# Altium schematic sheet Power Regulation.SchDoc
size A3
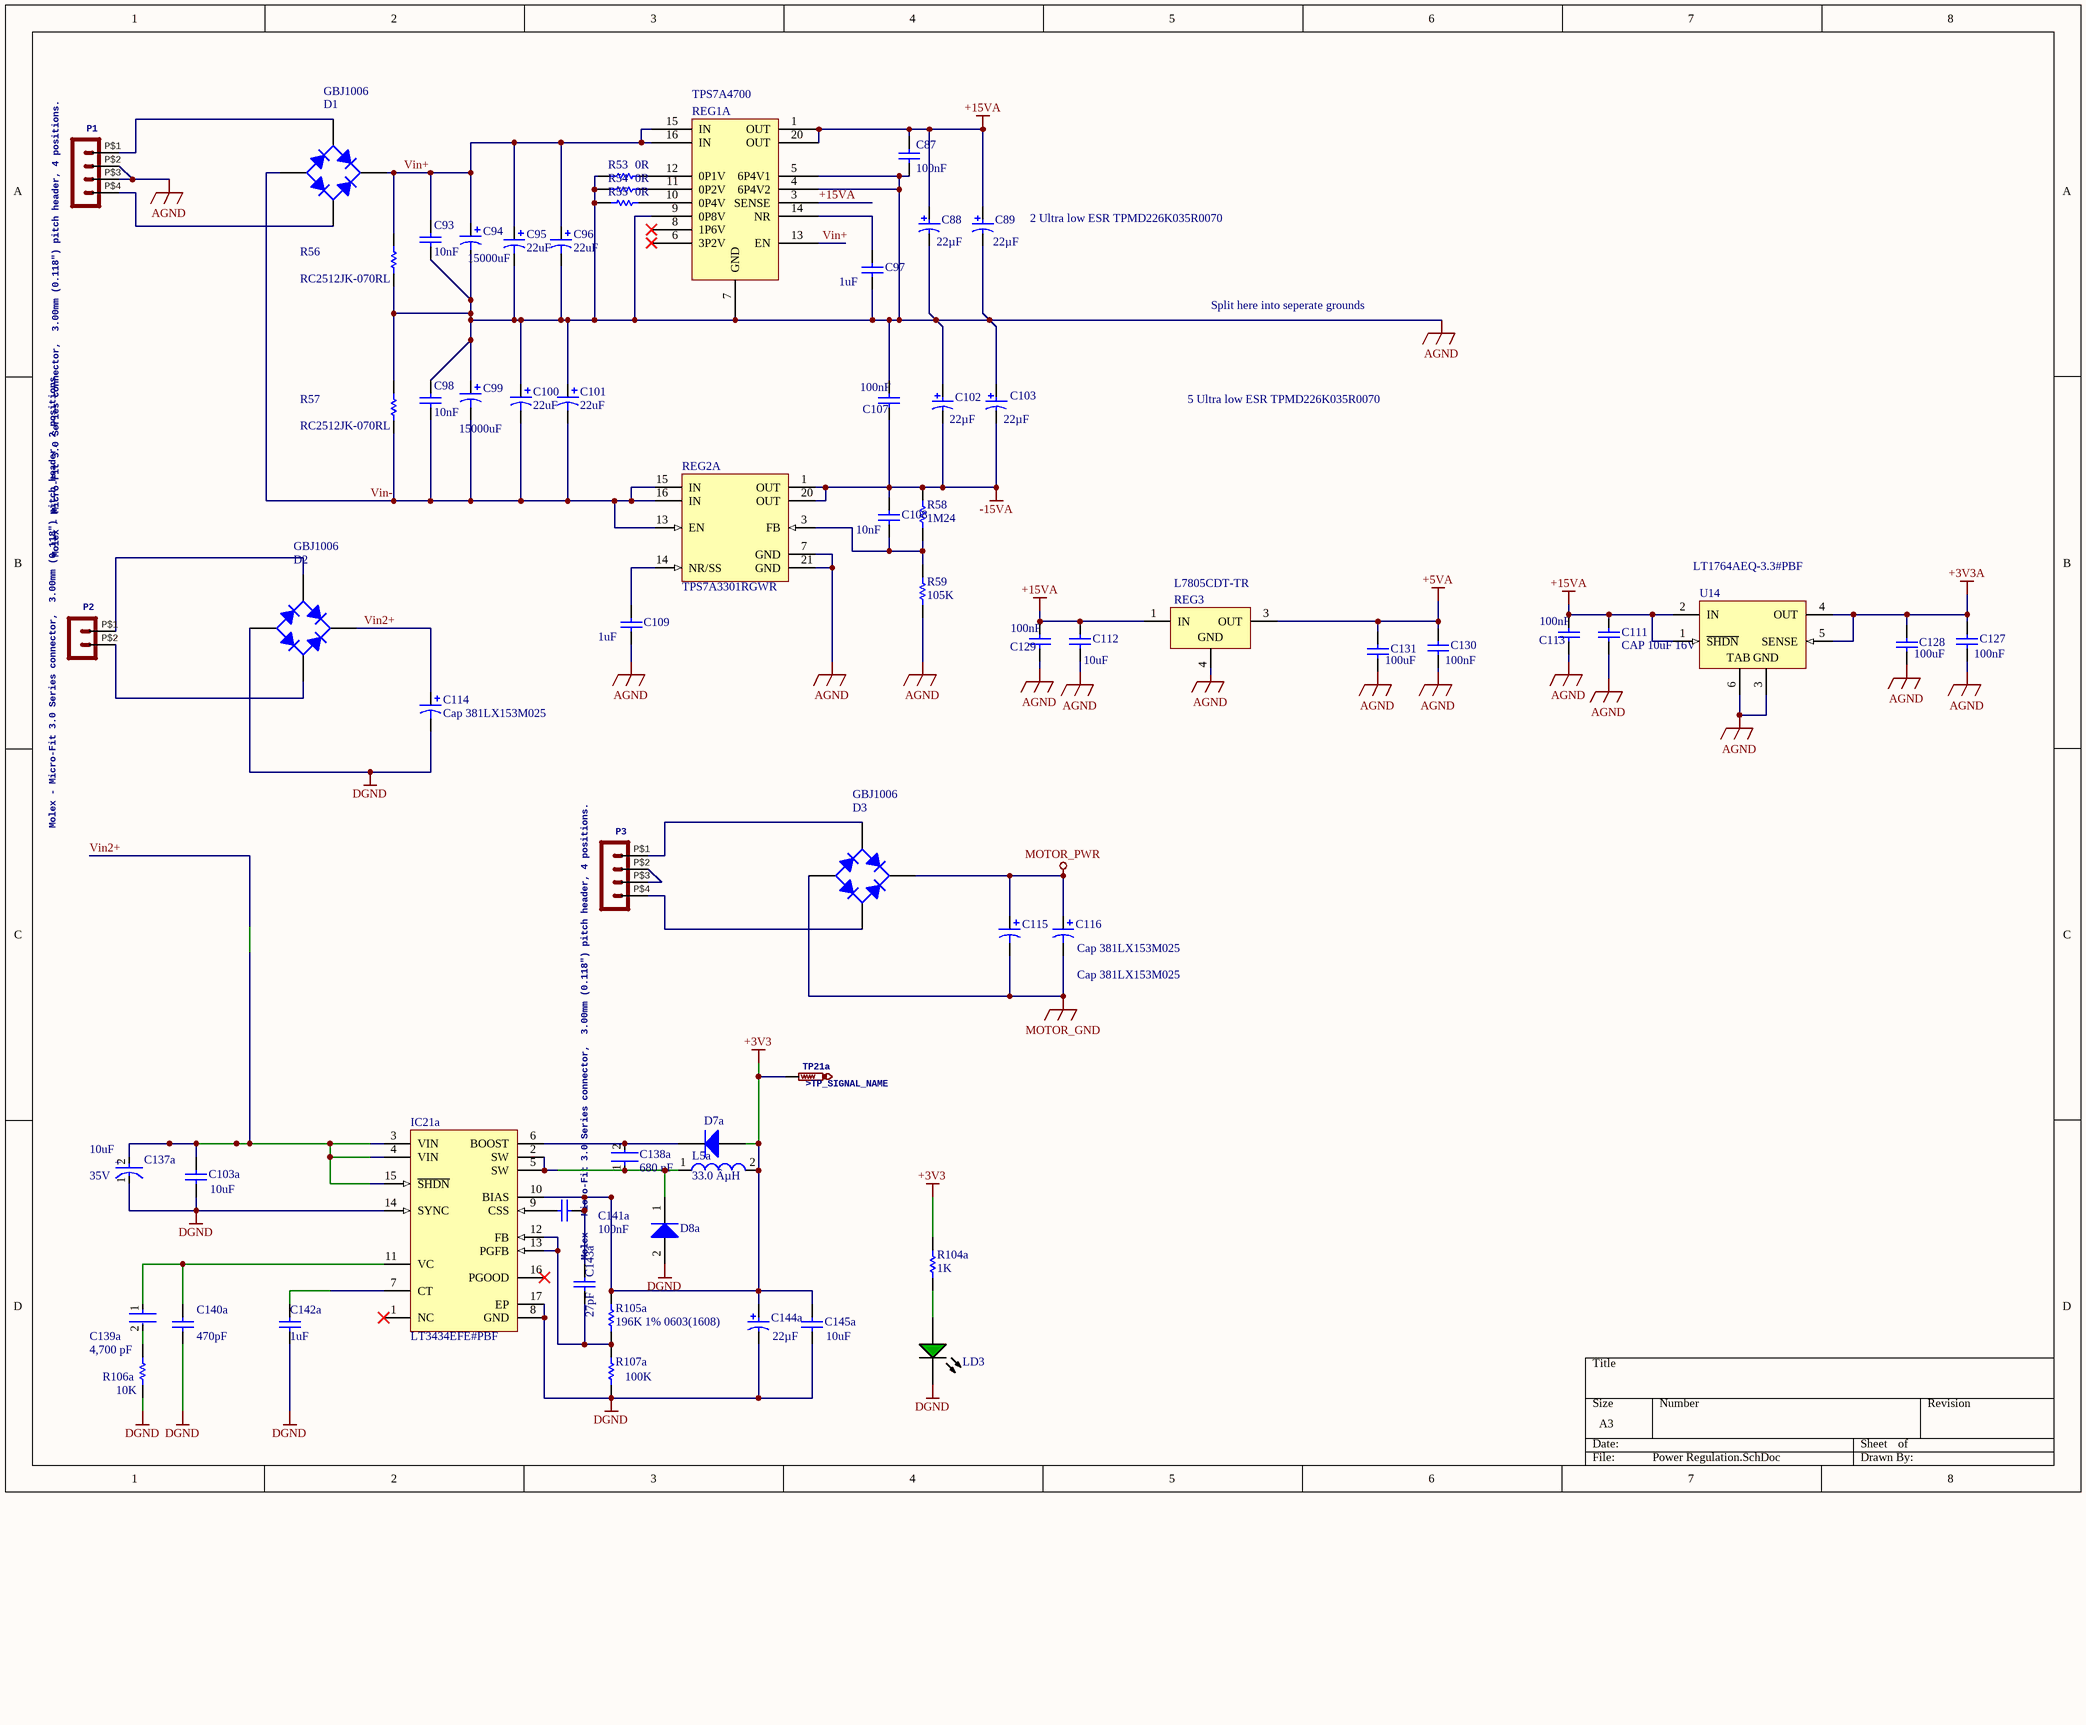
[diagram p0: Power Regulation.SchDoc]

## Parts
C87  value 100nF  [CAPC1206(3216)190_N]  (hidden comment: CAP 100nF 25V 1206(3216))
C88  Capacitance: 22µF  [CAPMP6032X28-T_V]  (hidden comment: TPSC226K025R0275)
C89  Capacitance: 22µF  [CAPMP6032X28-T_V]  (hidden comment: TPSC226K025R0275)
C93  value 10nF  [C0805]  (hidden comment: l)
C94  value 15000uF  [Cap 15000uF]  (hidden comment: Cap 381LX153M025)
C95  22uF  [Case D]
C96  22uF  [Case D]
C97  value 1uF  [C1206]  (hidden comment: l)
C98  value 10nF  [C0805]  (hidden comment: l)
C99  value 15000uF  [Cap 15000uF]  (hidden comment: Cap 381LX153M025)
C100  22uF  [Case D]
C101  22uF  [Case D]
C102  Capacitance: 22µF  [CAPMP6032X28-T_V]  (hidden comment: TPSC226K025R0275)
C103  Capacitance: 22µF  [CAPMP6032X28-T_V]  (hidden comment: TPSC226K025R0275)
C103a  Capacitance: 10uF  [CAPC3225X280X20LL40]  (hidden comment: CGA6P3X7S1H106K250AB)
C107  value 100nF  [CAPC1206(3216)190_N]  (hidden comment: CAP 100nF 25V 1206(3216))
C108  value 10nF  [C0805]  (hidden comment: l)
C109  value 1uF  [C1206]  (hidden comment: l)
C111  CAP 10uF 16V 1210(3225)  [CAPC1210(3225)230_N]
C112  value 10uF  [CAPC1210(3225)230_N]  (hidden comment: CAP 10uF 16V 1210(3225))
C113  value 100nF  [CAPC1206(3216)190_N]  (hidden comment: CAP 100nF 25V 1206(3216))
C114  Cap 381LX153M025  [Cap 15000uF]
C115  Cap 381LX153M025  [Cap 15000uF]
C116  Cap 381LX153M025  [Cap 15000uF]
C127  value 100nF  [CAPC1206(3216)190_N]  (hidden comment: CAP 100nF 25V 1206(3216))
C128  value 100uF  [CAPC1210(3225)280_M]  (hidden comment: CAP 100uF 6.3V 1210(3225))
C129  value 100nF  [CAPC1206(3216)190_N]  (hidden comment: CAP 100nF 25V 1206(3216))
C130  value 100nF  [CAPC1206(3216)190_N]  (hidden comment: CAP 100nF 25V 1206(3216))
C131  value 100uF  [CAPC1210(3225)280_M]  (hidden comment: CAP 100uF 6.3V 1210(3225))
C137a  value 10uF  Voltage Rating: 35V  [FP-TAJD-MFG]  (hidden comment: TAJD106M035RNJ)
C138a  value 680 nF  [FP-CC0603-DA-MFG]  (hidden comment: CC0603KRX7R7BB684)
C139a  value 4,700 pF  [FP-C0603C-CF-MFG]  (hidden comment: C0603C472G5GACTU)
C140a  value 470pF  [CAPC0603(1608)100_M]  (hidden comment: CAP 470pF 50V 0603(1608))
C141a  value 100nF  [CAPC0805(2012)100_L]  (hidden comment: CAP 100nF 16V 0805(2012))
C142a  value 1uF  [CAPC0805(2012)145_N]  (hidden comment: CAP 1uF 6.3V 0805(2012))
C143a  value 27pF  [CAPC0603(1608)100_L]  (hidden comment: CAP 27pF 50V 0603(1608))
C144a  Capacitance: 22µF  [CAPMP6032X28-T_V]  (hidden comment: TPSC226K025R0275)
C145a  Capacitance: 10uF  [CAPC3225X280X20LL40]  (hidden comment: CGA6P3X7S1H106K250AB)
D1  GBJ1006  [DIOD-GBJ-4_V]
D2  GBJ1006  [DIOD-GBJ-4_V]
D3  GBJ1006  [DIOD-GBJ-4_V]
D7a  JANTX1N4148-1  [MCSM-DO-35-2]  (value not drawn)
D8a  MBRS3201T3G  [ONSC-SMC-2-403-03_V]  (value not drawn)
IC21a  LT3434EFE#PBF  [LT-FE-16-EPV-BC_M]
L5a  Inductance: 33.0 ÂµH  [WE-PD-LS]  (hidden comment: 7447715330)
LD3  SML-LXT0805GW-TR  [LUMX-SML-LXT0805_V]  (value not drawn)
P1  Molex - Micro-Fit 3.0 Series connector,  3.00mm (0.118") pitch header, 4 positions.  [43650-0415]
P2  Molex - Micro-Fit 3.0 Series connector,  3.00mm (0.118") pitch header, 2 positions.  [43650-0215]
P3  Molex - Micro-Fit 3.0 Series connector,  3.00mm (0.118") pitch header, 4 positions.  [43650-0415]
R53  Resistance (Ohms): 0R  [RESC1608X55X35LL10T10]  (hidden comment: RC1608J000CS)
R54  Resistance (Ohms): 0R  [RESC1608X55X35LL10T10]  (hidden comment: RC1608J000CS)
R55  Resistance (Ohms): 0R  [RESC1608X55X35LL10T10]  (hidden comment: RC1608J000CS)
R56  RC2512JK-070RL  [RESC6431X65X50LL10T20]
R57  RC2512JK-070RL  [RESC6431X65X50LL10T20]
R58  1M24  [RESC0805(2012)_N]
R59  105K  [RESC0805(2012)_N]
R104a  value 1K  [RESC0805(2012)_M]  (hidden comment: 1K 1% 0805(2012))
R105a  196K 1% 0603(1608)  [RESC0603(1608)_L]
R106a  value 10K  [RESC0805(2012)_L]  (hidden comment: 10K 5% 0805(2012))
R107a  Resistance: 100K  [RESC1608X55X25ML10T15]  (hidden comment: RC0603FR-07100KL)
REG1  TPS7A4700  [RGW0020A_V]  (part A of 2)
REG2  TPS7A3301RGWR  [RGW0020A_V]  (part A of 2)
REG3  L7805CDT-TR  [TO-252_N]
TP21a  TP_SIGNAL_NAME: >TP_SIGNAL_NAME  [P1-13]  (hidden comment: PTR1PAD1-13)
U14  LT1764AEQ-3.3#PBF  [LT-Q-5_L]

## Nets
+3V3: C141a.2 C143a.2 C144a.1 C145a.2 D7a.1(A) IC21a.10(BIAS) L5a.2 R104a.2 R105a.1 TP21a.TP
+3V3A: C127.2 C128.1 U14.4(OUT) U14.5(SENSE)
+5VA: C130.2 C131.1 REG3.3(OUT)
+15VA: C87.2 C88.1 C89.1 C111.1 C112.1 C113.2 C129.2 REG1.1(OUT) REG1.3(SENSE) REG1.20(OUT) REG3.1(IN) U14.1(~{SHDN}) U14.2(IN)
-15VA: C102.2 C103.2 C107.1 C108.2 R58.2 REG2.1(OUT) REG2.20(OUT)
AGND: C87.1 C88.2 C89.2 C93.1 C94.2 C95.2 C96.2 C97.1 C98.2 C99.1 C100.1 C101.1 C102.1 C103.1 C107.2 C109.1 C111.2 C112.2 C113.1 C127.1 C128.2 C129.1 C130.1 C131.2 P1.P$2 P1.P$3 R53.1 R54.1 R55.1 R56.1 R57.2 R59.1 REG1.4(6P4V2) REG1.5(6P4V1) REG1.7(GND) REG1.9(0P8V) REG2.7(GND) REG2.21(GND) REG3.4(GND) U14.3(GND) U14.6(TAB)
DGND: C103a.1 C114.2 C137a.1(C) C140a.1 C142a.1 C144a.2 C145a.1 D2.4(K) D8a.2(A) IC21a.8(GND) IC21a.14(SYNC) IC21a.17(EP) LD3.2(K) R106a.1 R107a.1
MOTOR_GND: C115.2 C116.2 D3.4(K)
MOTOR_PWR: C115.1 C116.1 D3.1(A)
Vin2+: C103a.2 C114.1 C137a.2(A) D2.1(A) IC21a.3(VIN) IC21a.4(VIN) IC21a.15(~{SHDN})
Vin+: C93.2 C94.1 C95.1 C96.1 D1.1(A) R56.2 REG1.13(EN) REG1.15(IN) REG1.16(IN)
Vin-: C98.1 C99.2 C100.2 C101.2 D1.4(K) R57.1 REG2.13(EN) REG2.15(IN) REG2.16(IN)
NetC97_2: C97.2 REG1.14(NR)
NetC108_1: C108.1 R58.1 R59.2 REG2.3(FB)
NetC109_2: C109.2 REG2.14(NR/SS)
NetC138a_1: C138a.1 D8a.1(K) IC21a.2(SW) IC21a.5(SW) L5a.1
NetC138a_2: C138a.2 D7a.2(K) IC21a.6(BOOST)
NetC139a_1: C139a.1 C140a.2 IC21a.11(VC)
NetC139a_2: C139a.2 R106a.2
NetC141a_1: C141a.1 IC21a.9(CSS)
NetC142a_2: C142a.2 IC21a.7(CT)
NetC143a_1: C143a.1 IC21a.12(FB) IC21a.13(PGFB) R105a.2 R107a.2
NetD1_2: D1.2(C) P1.P$1
NetD1_3: D1.3(C) P1.P$4
NetD2_2: D2.2(C) P2.P$1
NetD2_3: D2.3(C) P2.P$2
NetD3_2: D3.2(C) P3.P$1
NetD3_3: D3.3(C) P3.P$4
NetLD3_1: LD3.1(A) R104a.1
NetP3_P$2: P3.P$2 P3.P$3
NetR53_2: R53.2 REG1.12(0P1V)
NetR54_2: R54.2 REG1.11(0P2V)
NetR55_2: R55.2 REG1.10(0P4V)

Not connected (* = marked no-connect by the designer): IC21a 1(NC)* 16(PGOOD)*; REG1 6(3P2V)* 8(1P6V)*

## Notes on the sheet
- (near C89) 2 Ultra low ESR TPMD226K035R0070
- Split here into seperate grounds
- 5 Ultra low ESR TPMD226K035R0070
- (in symbol CMP-04424-000020-1) +

## Library data of the parts
C87 C107 C113 C127 C129 C130 = CMP-1037-04187-1: CAP 100nF 25V ±2% 1206 (3216 Metric) Thickness 1.9mm SMD; Case-EIA: 1206; Tolerance: Â±2%; Case-Metric: 3216; Max Thickness: 1.9 mm; Technology: SMT; Rated Voltage: 25 V
C88 C89 C102 C103 C144a = CMP-2000-07295-1: Low ESR, 22 uF, 25 V, +/- 10%, -55 to 125 degC, 2-Pin SMD, RoHS, Tape and Reel; Manufacturer Size Code: C; Manufacturer: AVX; Voltage - Rated: 25V; Online Catalog: TPSSeries; Product Training Modules: ComponentSolutionsforSmartMeterApplications; ESR (Equivalent Series Resistance): 275mOhm; Featured Product: TPSCapacitors; Other Names: 478-3102-6; Type: Molded; Package / Case: 2312(6032Metric); Lifetime @ Temp.: -; Series: TPS; Datasheet Version: 01/2017; Tolerance: ±10%; Datasheet URL: http://datasheets.avx.com/TPS.pdf; Features: GeneralPurpose; Package Reference: CAPMP06032X28-T; Category: Capacitors; Operating Temperature: -55°C~125°C; Manufacturer URL: http://www.avx.com/; Mounting Technology: SurfaceMount; Package URL: http://www.avx.com/download/software/literature/AVX-Footprint-Library.pdf; Mounting Type: SurfaceMount; Packaging: Digi-Reel®; Package Description: 2-Pin Surface Mount Device, Body 6 x 3.25 mm; Family: TantalumCapacitors; Standard Package: 1; Lead Spacing: -
  C88 C89 C102 C103: Size / Dimension: 0.236"Lx0.126"W(6.00mmx3.20mm); Height - Seated (Max): 0.110"(2.80mm)
C93 C97 C98 C108 C109 = Cap: Capacitor; Published: 8-Jun-2000; LatestRevisionDate: 17-Jul-2002; LatestRevisionNote: Re-released for DXP Platform.; PackageReference: RAD-0.3; Publisher: Altium Limited; PackageDescription: Radial Cap, Thru-Hole; 2 Leads; 0.3 in Pin Spacing
C95 C96 C100 C101 = Polar Capacitor
C103a C145a = CMP-2000-07444-1: Chip Capacitor, 10 uF, +/- 10%, 50 V, -55 to 125 degC, 1210 (3225 Metric), RoHS, Tape and Reel; Manufacturer: TDK; Voltage: 50V; Dielectric: X7S; Case Code (Imperial): 1210; RoHSCompliant: True; Mounting Technology: SurfaceMount; Datasheet Version: 12/2014; Case Code (Metric): 3225; Min Operating Temperature: -55degC; Package Quantity: 1; Case/Package: 1210; Length: 3.2mm; Width: 0.098inch; Termination: SMD/SMT; Lead Free: LeadFree; REACH SVHC: NoSVHC; Height: 2.5mm; Package Description: 2-Pin Surface Mount Device, Body 3.2 x 2.5 mm; Max Operating Temperature: 125degC; Datasheet URL: https://product.tdk.com/info/en/catalog/datasheets/mlcc_automotive_general_en.pdf; Weight: 0.000564oz; Voltage Rating: 50V; Depth: 2.5mm; Thickness: 0.11inch; Package Reference: 1210; Manufacturer URL: http://www.tdk.com/; Voltage Rating (DC): 50V; Tolerance: 10%; Packaging: TapeandReel; Composition: Ceramic
C111 C112 = CMP-1038-02218-1: CAP 10uF 16V ±20% 1210 (3225 Metric) Thickness 2.3mm SMD; Case-Metric: 3225; Tolerance: Â±20%; Case-EIA: 1210; Technology: SMT; Max Thickness: 2.3 mm; Rated Voltage: 16 V
  C111: Value: 10uF
C128 C131 = CMP-1038-02302-1: CAP 100uF 6.3V ±20% 1210 (3225 Metric) Thickness 2.8mm SMD; Tolerance: Â±20%; Case-EIA: 1210; Case-Metric: 3225; Technology: SMT; Rated Voltage: 6.3 V; Max Thickness: 2.8 mm
C137a = CMP-04424-000020-1: CAP TANT 10UF 20% 35V 2917; Manufacturer: AVX; Life: 1000Hours; Esr: 1Ω; Leakage Current: 3.5uA; Material: Tantalum; Dissipation Factor: 6%; Package: TAJD; Lead Free: Yes; Capacitance: 10uF; Device Class L3: Tantalum Capacitors; Digikey Description: CAP TANT 10UF 20% 35V 2917; ComponentLink2URL: http://datasheets.avx.com/TAJ.pdf; Device Class L1: Passive Components; Device Class L2: Capacitors; Category: Cap; Mouser Description: Cap Tant Solid 10uF 35V D CASE 20% (7.3 X 4.3 X 2.9mm) Inward L SMD 7343-31 1 Ohm 125C T/R; Octopart: https://octopart.com/tajd106m035rnj-avx-3819655; ComponentLink2Description: Datasheet; Footprint Url: http://www.avx.com/download/software/literature/AVX-Footprint-Library.pdf; Temperature Range High: +125°C; Automotive: No; Height: 3.1mm; RoHS: TRUE; Manufacturer Part Number: TAJD106M035RNJ; Temperature: -55°C to +125°C; Tolerance: 20%; Temperature Range Low: -55°C
C138a = CMP-03422-000082-1: CAP CER 0.68UF 16V X7R 0603; Manufacturer: YAGEO; Tolerance: 0.1; Temperature Coefficient: 15%; Material: Ceramic; Device Class L3: Ceramic Capacitors; Digikey Description: CAP CER 0.68UF 16V X7R 0603; RoHS: TRUE; Footprint Url: http://www.yageo.com/exep/pages/download/literatures/UPY-C_GEN_24.pdf; ComponentLink2URL: http://www.yageo.com/documents/recent/UPY-GPHC_X7R_6.3V-to-50V_18.pdf; Device Class L1: Passive Components; Temperature Range Low: -55°C; Category: Cap; Mouser Description: 0603 16 V 680 nF X7R ±10% Tolerance Multilayer Ceramic Capacitor; ComponentLink2Description: Datasheet; Temperature Range High: +125°C; Capacitance: 680 nF; Temperature: -55°C to +125°C; Voltage: 16 V; Manufacturer Part Number: CC0603KRX7R7BB684; Automotive: No; Device Class L2: Capacitors; Height: 0.9mm; Lead Free: Yes; Package: CC0603-DA; Temperature Characteristic: X7R; Voltage Rating: 16 V; Octopart: https://octopart.com/cc0603krx7r7bb684-yageo-21707056
C139a = CMP-03020-006967-1: CAP CER 4700PF 50V NP0 0603; Manufacturer: KEMET; Temperature Characteristic: C0G; Tolerance: 0.02; Temperature Coefficient: 30ppm/°C; Automotive Grade: Grade 1; Material: Ceramic; Package: C0603C-CF; Mouser Description: Multilayer Ceramic Capacitors MLCC - SMD/SMT 50volts 4700pF 2% C0G; Lead Free: Yes; Voltage Rating: 50 V; Octopart: https://octopart.com/c0603c472g5gactu-kemet-19050074; ComponentLink2Description: Datasheet; RoHS: TRUE; Category: Cap; Manufacturer Part Number: C0603C472G5GACTU; Capacitance: 4,700 pF; Device Class L3: Ceramic Capacitors; ComponentLink2URL: https://api.kemet.com/component-edge/download/datasheet/C0603C100J5GACAUTO.pdf; Temperature Range Low: -55°C; Temperature: -55°C to +125°C; Device Class L2: Capacitors; Device Class L1: Passive Components; Automotive: Yes; Height: 0.87mm; Temperature Range High: +125°C; Digikey Description: CAP CER 4700PF 50V NP0 0603
C140a = CMP-1035-01675-1: CAP 470pF 50V ±5% 0603 (1608 Metric) Thickness 1mm SMD; Case-Metric: 1608; Tolerance: Â±5%; Case-EIA: 0603; Technology: SMT; Rated Voltage: 50 V; Max Thickness: 1 mm
C141a = CMP-1036-04400-1: CAP 100nF 16V ±5% 0805 (2012 Metric) Thickness 1mm SMD; Case-EIA: 0805; Tolerance: Â±5%; Case-Metric: 2012; Max Thickness: 1 mm; Technology: SMT; Rated Voltage: 16 V
C142a = CMP-1036-04731-1: CAP 1uF 6.3V ±10% 0805 (2012 Metric) Thickness 1.45mm SMD; Case-Metric: 2012; Case-EIA: 0805; Tolerance: Â±10%; Max Thickness: 1.45 mm; Technology: SMT; Rated Voltage: 6.3 V
C143a = CMP-1035-00889-1: CAP 27pF 50V ±10% 0603 (1608 Metric) Thickness 1mm SMD; Case-EIA: 0603; Tolerance: Â±10%; Case-Metric: 1608; Technology: SMT; Rated Voltage: 50 V; Max Thickness: 1 mm
D1-D3 = CMP-1229-00001-1: Glass Passivated Bridge Rectifier, 10 A, -65 to 150 degC, 4-Pin THD (GBJ), Tube; Manufacturer: Diodes Inc; Voltage-Peak Reverse: 600 V Max.; CT: 55 pF; VFM: 1.05 V; VR(RMS): 420 V; IFSM: 170 A; IO: 10 A; ComponentLink1Description: Manufacturer URL; Operating Temperature: -65 to 150 degC; ComponentLink3URL: http://diodes.com/datasheets/ds21218.pdf; DatasheetVersion: Rev. 7; PartNumber: GBJ1006; PackageDescription: 4-Pin Through Hole Device, Body 30 x 4.6 mm, Height 24 mm; ComponentLink3Description: Package Specification; Mounting Technology: Through Hole; ComponentLink2URL: http://diodes.com/datasheets/ds21218.pdf; ComponentLink2Description: Datasheet; Packing: Tube; ComponentLink1URL: http://www.diodes.com/
D7a = CMP-2000-06494-1: Glass Axial Switching Diode, 200 mA, 100 V, 2-Pin DO-35, RoHS, Bulk; Manufacturer: Microsemi; Peak Average Forward Current: 0.2A; Peak Reverse Recovery Time: 5ns; Rad Hard: No; Configuration: Single; Peak Forward Voltage: 1.2@0.1AV; Peak Reverse Repetitive Voltage: 75V; Breakdown Voltage: 100V; Peak Reverse Current: 0.5uA; Operating Temperature: -65to200°C; Package Description: 2-Pin Axial Lead, Dia 1.665 mm, Body Length 4.065 mm; PartNumber: 1N4148-1; Type: SwitchingDiode; Package: 2DO-35; Output Current: 0.2A; Mounting: ThroughHole; Mounting Technology: ThroughHole; Packaging: Bulk; Datasheet Version: Rev. 1, 11/2012; Manufacturer URL: http://www.microsemi.com/; Package Reference: DO-35-2; Datasheet URL: http://www.microsemi.com/document-portal/doc_download/125211-lds-0281
D8a = CMP-1055-00379-1: 200 V, 3 A Schottky Fast Soft-Recovery Power Rectifier, 2-Pin SMC, Pb-Free, Tape and Reel; Manufacturer: On Semiconductor; Configuration: Single; trr Max (ns): 35; IFSM Max (A): 100; PackageDescription: 2-Pin Small Molded Package, J-Bend Lead, Body 5.845 x 6.855 mm; ComponentLink2URL: http://www.onsemi.cn/pub_link/Collateral/MBRS3201T3-D.PDF; Packing: Tape and Reel; DatasheetVersion: Rev. 3; PartNumber: MBRS3201T3G; ComponentLink2Description: Datasheet; ComponentLink1URL: http://www.onsemi.com/; PackageVersion: Rev. E, 08/2005; PackageReference: SMC-2-403-03; ComponentLink1Description: Manufacturer URL; RoHS: TRUE; ComponentLink3Description: Package Specification; ComponentLink3URL: http://www.onsemi.com/pub_link/Collateral/403-03.PDF; Mounting Technology: Surface Mount
IC21a = CMP-0491-00607-1: High Voltage 3 A, 200 kHz Step-Down Switching Regulator with 100 uA Quiescent Current, 16-pin SOP (FE-16-EPV-BC), -40 to 125 degC, Pb-Free; Manufacturer: Linear Technology; Frequency Sync Range: 230kHz - 500kHz; Number of Outputs: 1; Mounting Technology: Surface Mount; DatasheetVersion: Rev. B; ComponentLink3Description: Package Specification; ComponentLink1URL: http://www.linear.com/; PackageDescription: 16-Pin Plastic TSSOP, Body 5 x 4.4 mm, Pitch 0.65 mm; ComponentLink2Description: Datasheet; ComponentLink1Description: Manufacturer URL; ComponentLink2URL: http://cds.linear.com/docs/en/datasheet/3434fb.pdf; PartNumber: LT3434EFE#PBF; ComponentLink3URL: http://cds.linear.com/docs/en/packaging/05081663__J_FE16(BC).pdf; PackageReference: FE-16; PackageVersion: Rev. J, 11/2012; RoHS: TRUE
L5a = CMP-0227-00710-1: SMD-Shielded Power Inductor WE-PD, L = 33.0 µH; PackageDescription: SMD Inductor, 2-Leads, Body 12.0 x 12.0 mm; ComponentLink2URL: http://www.we-online.de/katalog/media/pdf/7447715330.pdf; ComponentLink2Description: Datasheet; PackageVersion: 2008; ComponentLink1Description: Manufacturer Link; ComponentLink1URL: http://www.we-online.com; DatasheetVersion: ver 1, Nov-2008; PackageReference: WE-PD-LS
LD3 = CMP-1724-00001-1: LED, GREEN, 565 nm, 2 V, -25 to 80 degC, 2-Pin SMD, RoHS, Tape and Reel; Case\/Package: 0805; RoHSCompliant: true; REACH SVHC: No SVHC; Packaging: Tape and Reel; ComponentLink2URL: http://www.lumex.com/content/files/ProductAttachment/SML-LXT0805GW-TR.pdf; ComponentLink1URL: http://www.lumexinstruments.com/; Min Operating Temperature: -25 degC; Max Operating Temperature: 85 degC; DatasheetVersion: Rev. F, 09/2009; Case Code (Metric): 2012; Width: 1.25 mm; PackageDescription: 2-Pin Surface Mount Device, Body 2 x 1.25 mm; ComponentLink1Description: Manufacturer URL; Mount: Surface Mount; PackageReference: SML-LXT0805; Length: 2 mm; Case Code (Imperial): 0805; ComponentLink2Description: Datasheet; Package Quantity: 4000; Mounting Technology: Surface Mount
P1 P3 = HEADER_POS4_?43650-0415
P2 = HEADER_POS2_?43650-0215
R53-R55 = CMP-2000-06972-1: Chip Resistor, 0 Ohm, +/- 5%, 0.1 W, -55 to 155 degC, 0603 (1608 Metric), RoHS, Tape and Reel; Manufacturer: Samsung-Electro-Mechanics-America,-Inc.; Power (Watts): 0.1W,1/10W; Tolerance: Jumper; Manufacturer URL: http://www.samsungsem.com/global/index.jsp; Features: MoistureResistant; Mounting Technology: SurfaceMount; Series: RC; Package / Case: 0603(1608Metric); Category: Resistors; Operating Temperature: -55°C~155°C; Datasheet URL: http://static6.arrow.com/aropdfconversion/3cece72dd289ffbadc164fbcd05f638dd7240f7b/rc_datasheet_150330.pdf.pdf?authToken=eyJ0eXAiOiJKV1QiLCJhbGciOiJIUzI1NiJ9.eyJTZXNzaW9uSWQiOiJtY3ZlYXdxYmptZXdpdXdyeG1ha2FxdWciLCJEb3dubG9hZFR5cGUiOiJEYXRhc2hlZXRzIiwiaXNzIjoic2VsZiIsImF1ZCI6Imh0dHA6Ly9kYXRhc2hlZXRhdXRoLmFycm93LmNvbSIsImV4cCI6MTQ3Njg1OTQ5NiwibmJmIjoxNDc2ODU5Mzc2fQ.1rZWSrRNyHkP6J5YmszFzS2kzmlbN9BKNvWJ4ACiP-Q; Datasheet Version: 09/2015; Packaging: Digi-Reel®; Composition: ThickFilm; Package Description: 2-Pin Chip Resistor, Body 1.6 x 0.8 mm; Number of Terminations: 2; Height: 0.022"(0.55mm); Supplier Device Package: 0603; Family: ChipResistor-SurfaceMount; Package Reference: 0603; Temperature Coefficient: -; Size / Dimension: 0.063"Lx0.031"W(1.60mmx0.80mm)
R56 R57 = CMP-2000-06974-1: Chip Resistor, 0 Ohm, Jumper, 1 W, -55 to 125 degC, 2512 (6432 Metric)， RoHS, Tape and Reel; Manufacturer: Yageo; Product Range: RCSeries; Resistor Element Type: ThickFilm; Resistance: 0ohm; Power Rating: 2W; Temperature Coefficient: ±300ppm/°C; Resistor Case Style: 2512[6432Metric]; SVHC: ToBeAdvised; Voltage Rating: 200V; Resistance Tolerance: ±5%; Datasheet URL: http://www.yageo.com/documents/recent/PYu-RC_Group_51_RoHS_L_7.pdf; Package Description: 2-Pin Surface Mount Device, Body 6.35 x 3.1 mm; Manufacturer URL: http://www.yageo.com/; Mounting Technology: SurfaceMount; MSL: MSL1-Unlimited; Datasheet Version: Rev. 7, 05/2017; Packaging: CutTape; Automotive Qualification Standard: -; Package Reference: 2512
R58 R59 = CMP-1013-00849-1: 1M 0.125W 1% 0805 (2012 Metric)  SMD; Value: 1000000.00 Ohm; Case-Metric: 2012; Case-EIA: 0805; Technology: SMT; Power: 0.125 W; Tolerance: 1 %
R104a = CMP-1013-00510-1: 1K 0.125W 1% 0805 (2012 Metric)  SMD; Case-Metric: 2012; Case-EIA: 0805; Tolerance: 1 %; Power: 0.125 W; Technology: SMT
R105a = CMP-1012-00767-1: 196K 0.1W 1% 0603 (1608 Metric)  SMD; Case-EIA: 0603; Value: 196000.00 Ohm; Case-Metric: 1608; Power: 0.1 W; Tolerance: 1 %; Technology: SMT
R106a = CMP-1013-00098-1: 10K 0.125W 5% 0805 (2012 Metric)  SMD; Case-Metric: 2012; Case-EIA: 0805; Tolerance: 5 %; Power: 0.125 W; Technology: SMT
R107a = CMP-2100-03662-1: Chip Resistor, 100 KOhm, +/- 1%, 0.1 W, -55 to 155 degC, 0603 (1608 Metric), RoHS, Tape and Reel; Manufacturer: Yageo; Power Rating: 100mW; Voltage Rating: 50V; Temperature Coefficient: 100ppm/degreesC; Datasheet Version: Rev. 5, 10/2016; Height: 0.45mm; Lead Free: LeadFree; Manufacturer URL: http://www.yageo.com/; Package Reference: 0603; Depth: 0.8mm; RoHSCompliant: true; Composition: ThickFilm; Military Standard: Not; Case/Package: 0603; Packaging: TapeandReel; Case Code (Imperial): 0603; Voltage Rating (DC): 50V; Case Code (Metric): 1608; Tolerance: 1%; Termination: SMD/SMT; Min Operating Temperature: -55degC; Number of Pins: 2; Length: 1.6mm; Width: 0.8mm; Datasheet URL: http://www.yageo.com/NewPortal/yageodocoutput?fileName=/pdf/R-Chip/PYu-RC_Group_51_RoHS_L_5.pdf; Package Description: 2-Pin Surface Mount Device, Body 1.6 x 0.8 mm; Max Operating Temperature: 155degC; REACH SVHC: NoSVHC
REG2 = CMP-0395-01391-2: Single Output High PSRR LDO, 1 A, Adjustable -1.18 to -33 V Output, -3 to -36 V Input, with Ultra-Low Noise, 20-pin VQFN (RGW), -40 to 125 degC, Green (RoHS & no Sb/Br); Manufacturer: Texas Instruments; SubFamily: Single Channel LDO; Vdo(Typ)(mV): 290; Iq(Typ)(mA): 0.21; Iout(Max)(A): 1; Accuracy(%): 1.5; PackageDescription: 20-Pin Plastic Quad Flat No-Pin, 5 x 5 mm Body, 0.65 mm Pitch, 3.15 x 3.15 mm Exposed Pad; DatasheetVersion: SBVS169B; ComponentLink1Description: Manufacturer URL; ComponentLink2Description: Datasheet; PartNumber: TPS7A3301RGWR; Eco-Plan: Green (RoHS & no Sb/Br); Vin(Min)(V): -3; ComponentLink2URL: http://www.ti.com/general/docs/lit/getliterature.tsp?genericPartNumber=TPS7A3301&fileType=pdf; ComponentLink3Description: Package Specification; PackageReference: RGW0020A; Vout Adj(Max)(V): -33; Vin(Max)(V): -36; Vout Adj(Min)(V): -1.18; ComponentLink1URL: http://www.ti.com/; Code_JEDEC: MO-220; ComponentLink3URL: http://www.ti.com/litv/pdf/mpqf122b; Mounting Technology: Surface Mount; PartId: 1
REG3 = CMP-0244-00216-1: Positive Voltage Regulator, 3-Pin DPAK, Tape and Reel; PackageVersion: 2011; PackageReference: TO-252; DatasheetVersion: 16/11/2011; PackageDescription: 3-Pin Transistor Outline Package 2.28 mm Pitch, 9.7 mm Lead Span (DPAK); ComponentLink1URL: http://www.st.com; ComponentLink2Description: Datasheet; ComponentLink1Description: Manufacturer URL; ComponentLink2URL: http://www.st.com/internet/com/TECHNICAL_RESOURCES/TECHNICAL_LITERATURE/DATASHEET/CD00000444.pdf
TP21a = PTR1PAD1-13: TEST PIN
U14 = CMP-0476-01176-1: 3 A, Fast Transient Response, Low Noise, LDO Regulator, 2.7 to 20 V Vin, 3.3 V Vout, 5-pin DPAK (Q-5), -40 to 125 degC, Pb-Free; Manufacturer: Linear Technology; Number of Outputs: 1; Noise(uV): 40; Output Voltage: 3.3 V; Shutdown Current(uA): 0.01; PSRR(dB): 63; Dropout Voltage(V): 0.34; Vin Min(V): 2.7; Iout(mA): 3000; Vin Max(V): 20; Discrete Pass Element: no; ComponentLink3URL: http://cds.linear.com/docs/en/packaging/Q%20DD5%2005-08-1461%20Rev%20F.pdf; ComponentLink1URL: http://www.linear.com/; ComponentLink3Description: Package Specification; Mounting Technology: Surface Mount; PackageReference: Q-5; PackageVersion: Rev. F, 09/2011; RoHS: TRUE; Isupply(mA): 1; ComponentLink2Description: Datasheet; PackageDescription: 5-Pin Plastic DD Pak, Body 10.2235 x 8.89 mm, Pitch 1.702 mm; ComponentLink2URL: http://cds.linear.com/docs/en/datasheet/1764afb.pdf; PartNumber: LT1764AEQ-3.3#PBF; ComponentLink1Description: Manufacturer URL; DatasheetVersion: Rev. B